# Altium schematic sheet RaspberryMicroSD.SchDoc: Raspberry Pi MicroSD Card Slot
size A4; Date: 06/05/2013; DrawnBy: Pawel Poryzala; Revision: 1.0.0; SheetNumber: 1; SheetTotal: 1; Projectnumber: OWN-000; Size: A4
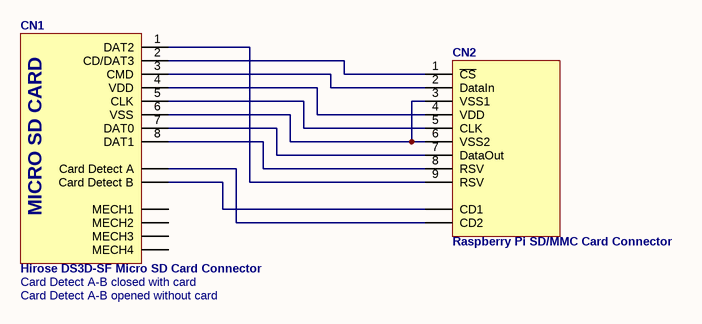
[diagram p0: RaspberryMicroSD.SchDoc]

## Parts
CN1  Hirose DS3D-SF Micro SD Card Connector  [DM3D-SF]
CN2  Raspberry Pi SD/MMC Card Connector  [PCBComponent_1]

## Nets
NetCN1_1: CN1.1(DAT2) CN2.9(RSV)
NetCN1_2: CN1.2(CD/DAT3) CN2.1(~{CS})
NetCN1_3: CN1.3(CMD) CN2.2(DataIn)
NetCN1_4: CN1.4(VDD) CN2.4(VDD)
NetCN1_5: CN1.5(CLK) CN2.5(CLK)
NetCN1_6: CN1.6(VSS) CN2.3(VSS1) CN2.6(VSS2)
NetCN1_7: CN1.7(DAT0) CN2.7(DataOut)
NetCN1_8: CN1.8(DAT1) CN2.8(RSV)
NetCN1_CD1: CN1.CD1(Card_Detect_A) CN2.CD2
NetCN1_CD2: CN1.CD2(Card_Detect_B) CN2.CD1

Not connected (* = marked no-connect by the designer): CN1 Mech1(MECH1) Mech2(MECH2) Mech3(MECH3) Mech4(MECH4)

## Notes on the sheet
- PROJECT NAME:
- PROJECT NO.:
- DATE:
- TITLE:
- SHEET
- of
- DRAWN BY:
- REVISION:
- FILENAME:
- A4
- (in symbol DM3D-SF) MICRO SD CARD; Card Detect A-B closed with card; Card Detect A-B opened without card

## Library data of the parts
CN1 = DM3D-SF: DM3D Micro SD, Push-Pull (no ejection mechanism) Card Connector; Producer: Hirose
CN2 = SD/MMC_1: SD/MMC Card Connector